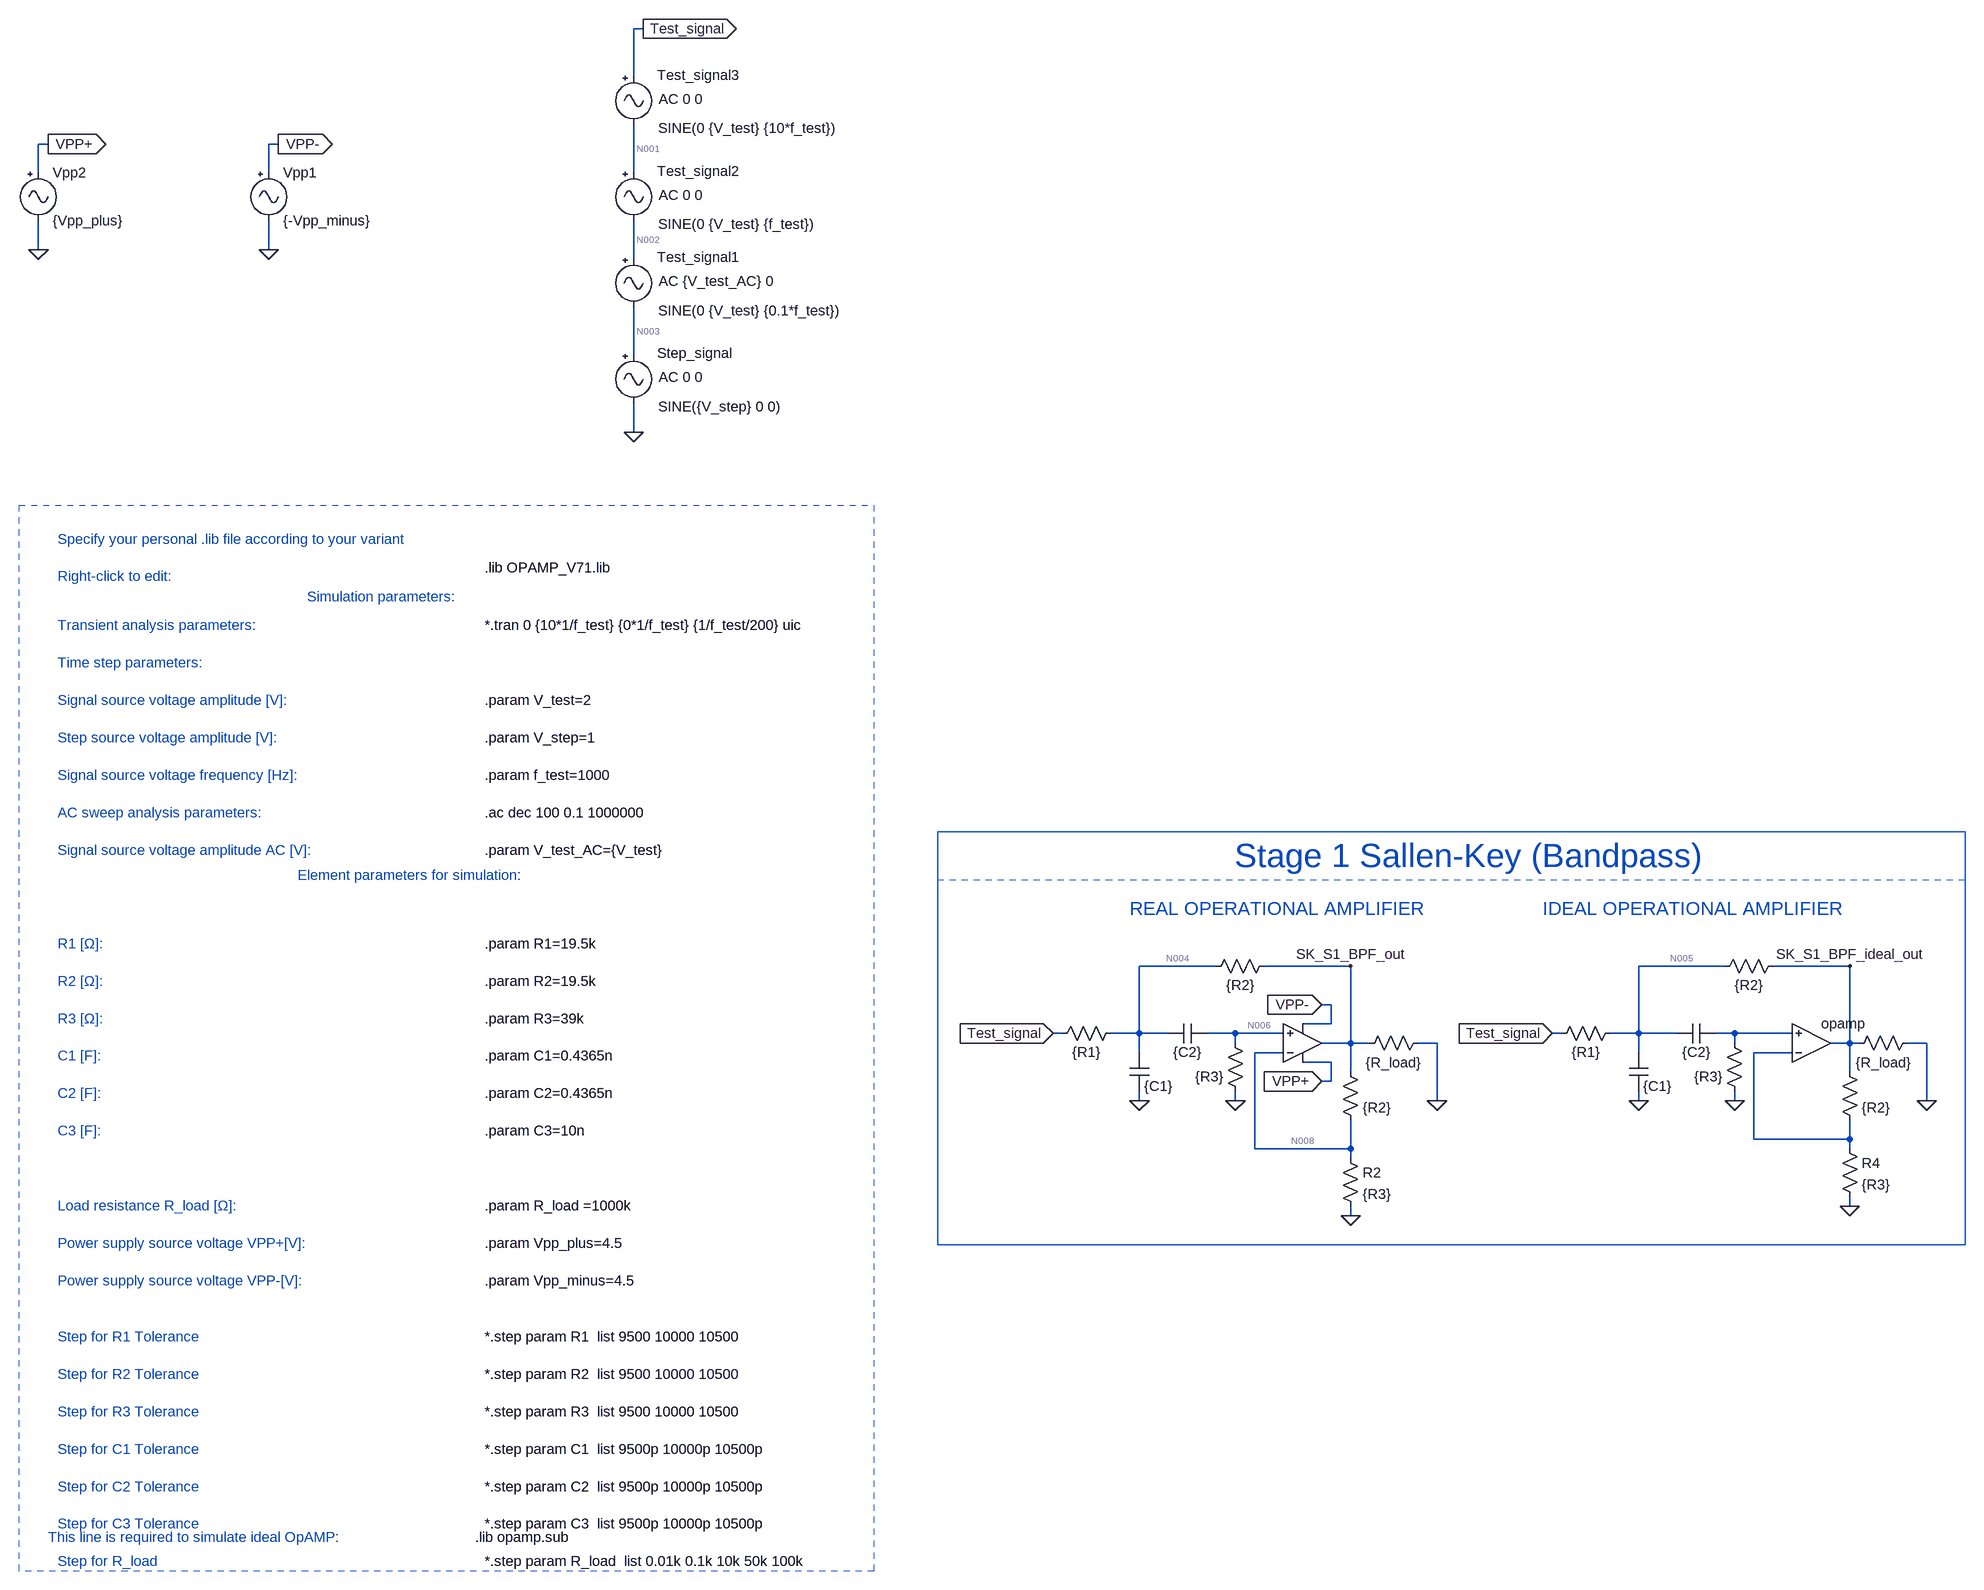
[diagram p0: schematic Practice 4 - Bandpass filters.asc]
Practice 4 - Bandpass filters.asc, the LTspice schematic file:
Version 4
SHEET 1 6772 2844
WIRE -1008 -1456 -1024 -1456
WIRE -1024 -1376 -1024 -1456
WIRE -2000 -1264 -2016 -1264
WIRE -1616 -1264 -1632 -1264
WIRE -2016 -1216 -2016 -1264
WIRE -1632 -1216 -1632 -1264
WIRE -1024 -1216 -1024 -1296
WIRE -2016 -1088 -2016 -1136
WIRE -1632 -1088 -1632 -1136
WIRE -1024 -1072 -1024 -1136
WIRE -1024 -912 -1024 -992
WIRE -1024 -784 -1024 -832
WIRE 32 128 -96 128
WIRE 256 128 112 128
WIRE 880 128 736 128
WIRE 1088 128 960 128
WIRE 224 192 208 192
WIRE 224 224 224 192
WIRE 224 224 176 224
WIRE -224 240 -240 240
WIRE -96 240 -96 128
WIRE -96 240 -144 240
WIRE -48 240 -96 240
WIRE 64 240 16 240
WIRE 144 240 64 240
WIRE 608 240 592 240
WIRE 736 240 736 128
WIRE 736 240 688 240
WIRE 800 240 736 240
WIRE 896 240 864 240
WIRE 992 240 896 240
WIRE 64 256 64 240
WIRE 256 256 256 128
WIRE 256 256 208 256
WIRE 288 256 256 256
WIRE 400 256 368 256
WIRE 896 256 896 240
WIRE 1088 256 1088 128
WIRE 1088 256 1056 256
WIRE 1104 256 1088 256
WIRE 1216 256 1184 256
WIRE -96 272 -96 240
WIRE 144 272 96 272
WIRE 736 272 736 240
WIRE 992 272 928 272
WIRE 224 288 176 288
WIRE 256 304 256 256
WIRE 1088 304 1088 256
WIRE 224 320 224 288
WIRE 224 320 208 320
WIRE -96 352 -96 336
WIRE 64 352 64 336
WIRE 400 352 400 256
WIRE 736 352 736 336
WIRE 896 352 896 336
WIRE 1216 352 1216 256
WIRE 928 416 928 272
WIRE 1088 416 1088 384
WIRE 1088 416 928 416
WIRE 96 432 96 272
WIRE 256 432 256 384
WIRE 256 432 96 432
WIRE 1088 432 1088 416
WIRE 256 448 256 432
WIRE 1088 528 1088 512
WIRE 256 544 256 528
FLAG 64 352 0
FLAG 208 320 VPP+
IOPIN 208 320 In
FLAG 208 192 VPP-
IOPIN 208 192 In
FLAG -240 240 Test_signal
IOPIN -240 240 In
FLAG 400 352 0
FLAG -96 352 0
FLAG 896 352 0
FLAG 592 240 Test_signal
IOPIN 592 240 In
FLAG 1216 352 0
FLAG 736 352 0
FLAG -2016 -1088 0
FLAG -1632 -1088 0
FLAG -2000 -1264 VPP+
IOPIN -2000 -1264 Out
FLAG -1616 -1264 VPP-
IOPIN -1616 -1264 Out
FLAG -1024 -784 0
FLAG -1008 -1456 Test_signal
IOPIN -1008 -1456 Out
FLAG 256 544 0
FLAG 1088 528 0
FLAG 256 128 SK_S1_BPF_out
FLAG 1088 128 SK_S1_BPF_ideal_out
SYMBOL OpAmps\\opamp2 176 320 M180
WINDOW 0 16 32 Invisible 2
WINDOW 3 16 96 Invisible 2
SYMATTR InstName U14
SYMATTR Value OPAMP_VarNo
SYMBOL res 128 112 R90
WINDOW 0 0 56 Invisible 2
WINDOW 3 32 56 VTop 2
SYMATTR InstName R_8
SYMATTR Value {R2}
SYMBOL res 384 240 R90
WINDOW 0 0 56 Invisible 2
WINDOW 3 33 56 VTop 2
SYMATTR InstName R24
SYMATTR Value {R_load}
SYMBOL cap -112 272 R0
WINDOW 0 24 8 Invisible 2
SYMATTR InstName C_7
SYMATTR Value {C1}
SYMBOL cap 16 224 R90
WINDOW 0 0 32 Invisible 2
WINDOW 3 32 32 VTop 2
SYMATTR InstName C_8
SYMATTR Value {C2}
SYMBOL res -128 224 R90
WINDOW 0 0 56 Invisible 2
WINDOW 3 32 56 VTop 2
SYMATTR InstName R29
SYMATTR Value {R1}
SYMATTR SpiceLine tol=10
SYMBOL res 80 352 R180
WINDOW 0 36 76 Invisible 2
WINDOW 3 36 40 Left 2
SYMATTR InstName Ri7
SYMATTR Value {R3}
SYMBOL res 1200 240 R90
WINDOW 0 0 56 Invisible 2
WINDOW 3 33 56 VTop 2
SYMATTR InstName R28
SYMATTR Value {R_load}
SYMBOL cap 720 272 R0
WINDOW 0 24 8 Invisible 2
SYMATTR InstName C_9
SYMATTR Value {C1}
SYMBOL cap 864 224 R90
WINDOW 0 0 32 Invisible 2
WINDOW 3 32 32 VTop 2
SYMATTR InstName C_10
SYMATTR Value {C2}
SYMBOL res 704 224 R90
WINDOW 0 0 56 Invisible 2
WINDOW 3 32 56 VTop 2
SYMATTR InstName R30
SYMATTR Value {R1}
SYMATTR SpiceLine tol=10
SYMBOL res 912 352 R180
WINDOW 0 36 76 Invisible 2
WINDOW 3 36 40 Left 2
SYMATTR InstName Ri6
SYMATTR Value {R3}
SYMBOL res 976 112 R90
WINDOW 0 0 56 Invisible 2
WINDOW 3 32 56 VTop 2
SYMATTR InstName R_7
SYMATTR Value {R2}
SYMBOL OpAmps\\opamp 1024 320 M180
WINDOW 0 0 32 Invisible 2
SYMATTR InstName U16
SYMBOL Misc\\signal -1024 -928 R0
WINDOW 123 42 53 Left 2
WINDOW 39 0 0 Left 0
WINDOW 0 39 13 Left 2
WINDOW 3 41 102 Left 2
SYMATTR Value2 AC 0 0
SYMATTR InstName Step_signal
SYMATTR Value SINE({V_step} 0 0)
SYMBOL Misc\\signal -1632 -1232 R0
WINDOW 123 0 0 Left 0
WINDOW 39 0 0 Left 0
SYMATTR InstName Vpp1
SYMATTR Value {-Vpp_minus}
SYMBOL Misc\\signal -2016 -1232 R0
WINDOW 123 0 0 Left 0
WINDOW 39 0 0 Left 0
SYMATTR InstName Vpp2
SYMATTR Value {Vpp_plus}
SYMBOL Misc\\signal -1024 -1232 R0
WINDOW 123 42 53 Left 2
WINDOW 39 0 0 Left 0
WINDOW 0 39 13 Left 2
WINDOW 3 41 102 Left 2
SYMATTR Value2 AC 0 0
SYMATTR InstName Test_signal2
SYMATTR Value SINE(0 {V_test} {f_test})
SYMBOL Misc\\signal -1024 -1392 R0
WINDOW 123 42 53 Left 2
WINDOW 39 0 0 Left 0
WINDOW 0 39 13 Left 2
WINDOW 3 41 102 Left 2
SYMATTR Value2 AC 0 0
SYMATTR InstName Test_signal3
SYMATTR Value SINE(0 {V_test} {10*f_test})
SYMBOL Misc\\signal -1024 -1088 R0
WINDOW 123 42 53 Left 2
WINDOW 39 0 0 Left 0
WINDOW 0 39 13 Left 2
WINDOW 3 41 102 Left 2
SYMATTR Value2 AC {V_test_AC} 0
SYMATTR InstName Test_signal1
SYMATTR Value SINE(0 {V_test} {0.1*f_test})
SYMBOL res 240 288 R0
WINDOW 0 36 40 Invisible 2
SYMATTR InstName R1
SYMATTR Value {R2}
SYMBOL res 240 432 R0
SYMATTR InstName R2
SYMATTR Value {R3}
SYMBOL res 1072 288 R0
WINDOW 0 36 40 Invisible 2
SYMATTR InstName R3
SYMATTR Value {R2}
SYMBOL res 1072 416 R0
SYMATTR InstName R4
SYMATTR Value {R3}
TEXT -1272 -440 Left 2 !*.tran 0 {10*1/f_test} {0*1/f_test} {1/f_test/200} uic\n \n \n \n.param V_test=2\n \n.param V_step=1\n \n.param f_test=1000\n \n.ac dec 100 0.1 1000000\n \n.param V_test_AC={V_test}\n \n \n  \n  \n.param R1=19.5k\n \n.param R2=19.5k\n \n.param R3=39k\n \n.param C1=0.4365n\n \n.param C2=0.4365n\n \n.param C3=10n\n \n \n \n.param R_load =1000k\n \n.param Vpp_plus=4.5\n \n.param Vpp_minus=4.5\n \n  \n*.step param R1  list 9500 10000 10500 \n \n*.step param R2  list 9500 10000 10500\n \n*.step param R3  list 9500 10000 10500\n \n*.step param C1  list 9500p 10000p 10500p\n \n*.step param C2  list 9500p 10000p 10500p\n \n*.step param C3  list 9500p 10000p 10500p\n \n*.step param R_load  list 0.01k 0.1k 10k 50k 100k
TEXT -1272 -536 Left 2 !.lib OPAMP_V71.lib
TEXT -1984 -584 Left 2 ;Specify your personal .lib file according to your variant\n \nRight-click to edit:
TEXT -1568 -488 Left 2 ;Simulation parameters:
TEXT -1584 -24 Left 2 ;Element parameters for simulation:
TEXT -1984 -440 Left 2 ;Transient analysis parameters:\n \nTime step parameters:\n \nSignal source voltage amplitude [V]:\n \nStep source voltage amplitude [V]:\n \nSignal source voltage frequency [Hz]:\n \nAC sweep analysis parameters:\n \nSignal source voltage amplitude AC [V]:\n  \n \n \n \nR1 [Ω]:\n \nR2 [Ω]:\n \nR3 [Ω]:\n \nC1 [F]:\n \nC2 [F]:\n \nC3 [F]:\n \n \n \nLoad resistance R_load [Ω]:\n \nPower supply source voltage VPP+[V]:\n \nPower supply source voltage VPP-[V]: \n \n \nStep for R1 Tolerance\n \nStep for R2 Tolerance\n \nStep for R3 Tolerance\n \nStep for C1 Tolerance \n \nStep for C2 Tolerance\n \nStep for C3 Tolerance \n \nStep for R_load
TEXT -1288 1080 Left 2 !.lib opamp.sub
TEXT -2000 1080 Left 2 ;This line is required to simulate ideal OpAMP:
TEXT 576 32 Left 3 ;IDEAL OPERATIONAL AMPLIFIER
TEXT -112 32 Left 3 ;REAL OPERATIONAL AMPLIFIER
TEXT 456 -56 Center 5 ;Stage 1 Sallen-Key (Bandpass)
RECTANGLE Normal -624 1136 -2048 -640 2
RECTANGLE Normal 1280 592 -432 -16 2
RECTANGLE Normal -432 -96 1280 592

The netlist it stands for:
* Practice 4 - Bandpass filters.asc
XU14 N006 N008 VPP+ VPP- SK_S1_BPF_out OPAMP_VarNo  ; pins In+ In- V+ V- OUT
R_8 SK_S1_BPF_out N004 {R2}
R24 0 SK_S1_BPF_out {R_load}
C_7 N004 0 {C1}
C_8 N006 N004 {C2}
R29 N004 Test_signal {R1} tol=10
Ri7 0 N006 {R3}
R28 0 SK_S1_BPF_ideal_out {R_load}
C_9 N005 0 {C1}
C_10 N007 N005 {C2}
R30 N005 Test_signal {R1} tol=10
Ri6 0 N007 {R3}
R_7 SK_S1_BPF_ideal_out N005 {R2}
XU16 N009 N007 SK_S1_BPF_ideal_out opamp Aol=100K GBW=10Meg  ; pins invin noninvin out
V§Step_signal N003 0 SINE({V_step} 0 0) AC 0 0
Vpp1 VPP- 0 {-Vpp_minus}
Vpp2 VPP+ 0 {Vpp_plus}
V§Test_signal2 N001 N002 SINE(0 {V_test} {f_test}) AC 0 0
V§Test_signal3 Test_signal N001 SINE(0 {V_test} {10*f_test}) AC 0 0
V§Test_signal1 N002 N003 SINE(0 {V_test} {0.1*f_test}) AC {V_test_AC} 0
R1 SK_S1_BPF_out N008 {R2}
R2 N008 0 {R3}
R3 SK_S1_BPF_ideal_out N009 {R2}
R4 N009 0 {R3}
*.tran 0 {10*1/f_test} {0*1/f_test} {1/f_test/200} uic
.param V_test=2
.param V_step=1
.param f_test=1000
.ac dec 100 0.1 1000000
.param V_test_AC={V_test}
.param R1=19.5k
.param R2=19.5k
.param R3=39k
.param C1=0.4365n
.param C2=0.4365n
.param C3=10n
.param R_load =1000k
.param Vpp_plus=4.5
.param Vpp_minus=4.5
*.step param R1  list 9500 10000 10500
*.step param R2  list 9500 10000 10500
*.step param R3  list 9500 10000 10500
*.step param C1  list 9500p 10000p 10500p
*.step param C2  list 9500p 10000p 10500p
*.step param C3  list 9500p 10000p 10500p
*.step param R_load  list 0.01k 0.1k 10k 50k 100k
.lib OPAMP_V71.lib
* Specify your personal .lib file according to your variant
* Right-click to edit:
* Simulation parameters:
* Element parameters for simulation:
* Transient analysis parameters:
* Time step parameters:
* Signal source voltage amplitude [V]:
* Step source voltage amplitude [V]:
* Signal source voltage frequency [Hz]:
* AC sweep analysis parameters:
* Signal source voltage amplitude AC [V]:
* R1 [Ω]:
* R2 [Ω]:
* R3 [Ω]:
* C1 [F]:
* C2 [F]:
* C3 [F]:
* Load resistance R_load [Ω]:
* Power supply source voltage VPP+[V]:
* Power supply source voltage VPP-[V]:
* Step for R1 Tolerance
* Step for R2 Tolerance
* Step for R3 Tolerance
* Step for C1 Tolerance
* Step for C2 Tolerance
* Step for C3 Tolerance
* Step for R_load
.lib opamp.sub
* This line is required to simulate ideal OpAMP:
* IDEAL OPERATIONAL AMPLIFIER
* REAL OPERATIONAL AMPLIFIER
* Stage 1 Sallen-Key (Bandpass)
.backanno
.end

* Results of the author's LTspice run, read from the files saved beside the schematic
* Operating Point, zero values left out:
*   V(sk_s1_bpf_out) = 15.16 µV
*   V(vpp-) = -4.5 V
*   V(vpp+) = 4.5 V
*   V(n008) = 9.657 µV
*   V(n006) = -1.348 µV
*   V(n004) = 500 mV
*   V(test_signal) = 1 V
*   V(n005) = 500 mV
*   V(n003) = 1 V
*   V(n001) = 1 V
*   V(n002) = 1 V
*   I(R2) = 247.6 pA
*   I(R1) = 282.2 pA
*   I(R_7) = -25.64 µA
*   I(R30) = -25.64 µA
*   I(Ri7) = 34.55 pA
*   I(R29) = -25.64 µA
*   I(R24) = -15.16 pA
*   I(R_8) = -25.64 µA
*   I(Test_signal1) = -51.28 µA
*   I(Test_signal3) = -51.28 µA
*   I(Test_signal2) = -51.28 µA
*   I(Vpp2) = -4.395 mA
*   I(Vpp1) = 4.395 mA
*   I(Step_signal) = -51.28 µA
*   Ix(u14:1) = 34.55 pA
*   Ix(u14:2) = 34.55 pA
*   Ix(u14:3) = 4.395 mA
*   Ix(u14:4) = -4.395 mA
*   Ix(u14:5) = 25.64 µA
*   Ix(u16:3) = 25.64 µA
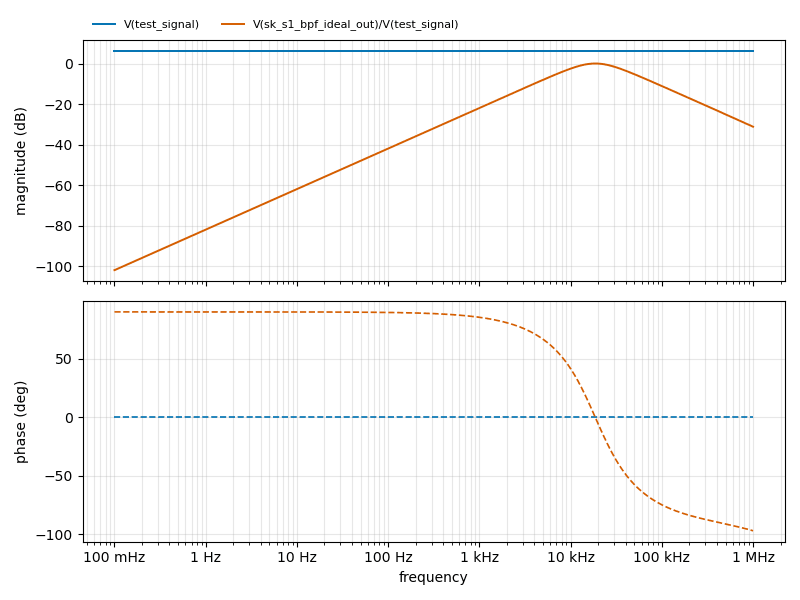
[diagram p1: AC Analysis of Practice 4 - Bandpass filters.asc, plotted from the saved traces]
* AC Analysis, 1 run:
*   V(test_signal): 6.02 dB at 100 mHz, 6.02 dB at 1 MHz, peak 6.02 dB at 100 mHz
*   V(sk_s1_bpf_ideal_out)/V(test_signal): -101.91 dB at 100 mHz, -31.18 dB at 1 MHz, peak -0.00 dB at 18.62 kHz, 3 dB below the peak at 9.341 kHz and 37.27 kHz